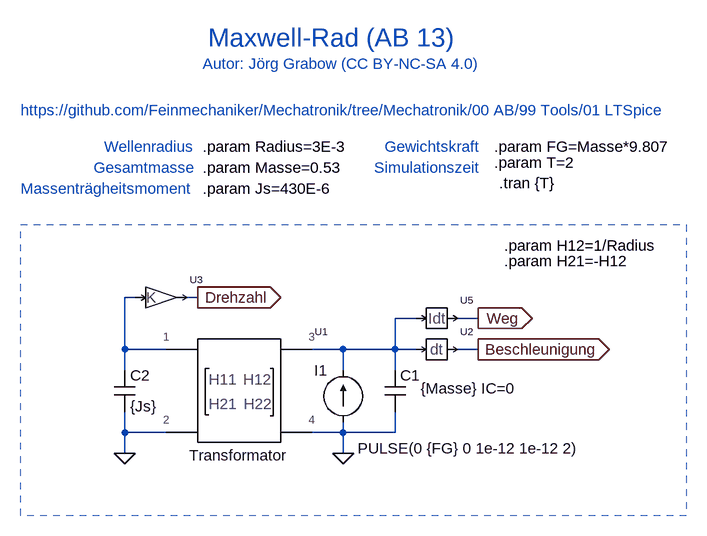
[diagram p0: schematic LAB_13.asc]
LAB_13.asc, the LTspice schematic file:
Version 4
SHEET 1 880 680
WIRE -224 -16 -240 -16
WIRE -128 -16 -144 -16
WIRE 208 16 176 16
WIRE 304 16 272 16
WIRE -240 64 -240 -16
WIRE -176 64 -240 64
WIRE 96 64 48 64
WIRE 176 64 176 16
WIRE 176 64 96 64
WIRE 208 64 176 64
WIRE 304 64 272 64
WIRE -240 96 -240 64
WIRE 96 96 96 64
WIRE 176 96 176 64
WIRE -240 192 -240 160
WIRE -176 192 -240 192
WIRE 96 192 96 176
WIRE 96 192 48 192
WIRE 176 192 176 160
WIRE 176 192 96 192
WIRE -240 224 -240 192
WIRE 96 224 96 192
FLAG 96 224 0
FLAG -240 224 0
FLAG 304 64 Beschleunigung
IOPIN 304 64 Out
FLAG 304 16 Weg
IOPIN 304 16 Out
FLAG -128 -16 Drehzahl
IOPIN -128 -16 Out
SYMBOL Mechatronik\\Wandler\\Transformator -64 112 R0
WINDOW 38 0 115 Center 2
SYMATTR InstName U1
SYMATTR Value H11=1E-9
SYMATTR Value2 H12={H12}
SYMATTR SpiceLine H21=-{H21}
SYMATTR SpiceLine2 H22=1E-9
SYMBOL cap 160 96 R0
WINDOW 3 55 28 Left 2
SYMATTR Value {Masse} IC=0
SYMATTR InstName C1
SYMBOL cap -256 96 R0
SYMATTR InstName C2
SYMATTR Value {Js}
SYMBOL current 96 176 R180
WINDOW 0 24 80 Left 2
WINDOW 3 -366 -40 Left 2
WINDOW 123 0 0 Left 0
WINDOW 39 0 0 Left 0
SYMATTR InstName I1
SYMATTR Value PULSE(0 {FG} 0 1e-12 1e-12 2)
SYMBOL Math\\Idt 240 16 R0
SYMATTR InstName U5
SYMBOL Math\\dt 240 64 R0
SYMATTR InstName U2
SYMBOL Math\\Gain -176 -16 R0
SYMATTR Value K=1/(2*3.14)
SYMATTR InstName U3
TEXT 328 -248 Left 2 !.param FG=Masse*9.807
TEXT 336 -192 Left 2 !.tran {T}
TEXT -120 -216 Left 2 !.param Masse=0.53
TEXT -120 -184 Left 2 !.param Js=430E-6
TEXT -120 -248 Left 2 !.param Radius=3E-3
TEXT -112 -416 Left 4 ;Maxwell-Rad (AB 13)
TEXT -400 -304 Left 2 ;https://github.com/Feinmechaniker/Mechatronik/tree/Mechatronik/00 AB/99 Tools/01 LTSpice
TEXT -120 -376 Left 2 ;Autor: Jörg Grabow (CC BY-NC-SA 4.0)
TEXT -272 -248 Left 2 ;Wellenradius
TEXT -288 -216 Left 2 ;Gesamtmasse
TEXT -400 -184 Left 2 ;Massenträgheitsmoment
TEXT 160 -248 Left 2 ;Gewichtskraft
TEXT 144 -216 Left 2 ;Simulationszeit
TEXT 328 -224 Left 2 !.param T=2
TEXT 344 -96 Left 2 !.param H12=1/Radius
TEXT 344 -72 Left 2 !.param H21=-H12
RECTANGLE Normal 624 320 -400 -128 2

The netlist it stands for:
* LAB_13.asc
XU1 N001 0 N002 0 Transformator H11=1E-9 H12={H12} H21=-{H21} H22=1E-9  ; pins 1 2 3 4
C1 N002 0 {Masse} IC=0
C2 N001 0 {Js}
I1 0 N002 PULSE(0 {FG} 0 1e-12 1e-12 2)
XU5 N002 Weg CIDT c0=0  ; pins I O
XU2 N002 Beschleunigung CDT  ; pins I O
XU3 N001 Drehzahl Gain K=1/(2*3.14)
.param FG=Masse*9.807
.tran {T}
.param Masse=0.53
.param Js=430E-6
.param Radius=3E-3
* Maxwell-Rad (AB 13)
* https://github.com/Feinmechaniker/Mechatronik/tree/Mechatronik/00 AB/99 Tools/01 LTSpice
* Autor: Jörg Grabow (CC BY-NC-SA 4.0)
* Wellenradius
* Gesamtmasse
* Massenträgheitsmoment
* Gewichtskraft
* Simulationszeit
.param T=2
.param H12=1/Radius
.param H21=-H12
.lib Mechatronik.lib
.lib Math.lib
.backanno
.end